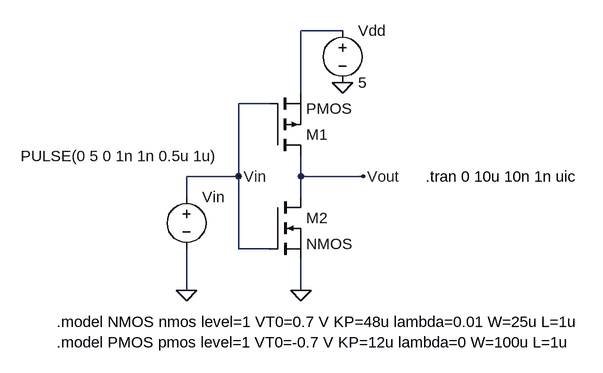
[diagram p0: schematic schema 1.3 Luca Fantin 2000156.asc]
schema 1.3 Luca Fantin 2000156.asc, the LTspice schematic file:
Version 4
SHEET 1 880 680
WIRE 320 -96 256 -96
WIRE 256 0 256 -96
WIRE 208 16 160 16
WIRE 160 128 160 16
WIRE 160 128 80 128
WIRE 256 128 256 96
WIRE 352 128 256 128
WIRE 80 160 80 128
WIRE 256 160 256 128
WIRE 160 240 160 128
WIRE 208 240 160 240
WIRE 80 304 80 240
WIRE 256 304 256 256
FLAG 352 128 Vout
FLAG 256 304 0
FLAG 320 -16 0
FLAG 80 304 0
FLAG 160 128 Vin
SYMBOL nmos 208 160 R0
SYMATTR InstName M2
SYMBOL voltage 320 -112 R0
SYMATTR InstName Vdd
SYMATTR Value 5
SYMBOL voltage 80 144 R0
WINDOW 3 -255 -47 Left 2
WINDOW 123 0 0 Left 0
WINDOW 39 0 0 Left 0
SYMATTR Value PULSE(0 5 0 1n 1n 0.5u 1u)
SYMATTR InstName Vin
SYMBOL pmos 208 96 M180
SYMATTR InstName M1
TEXT -120 352 Left 2 !.model NMOS nmos level=1 VT0=0.7 V KP=48u lambda=0.01 W=25u L=1u
TEXT -120 384 Left 2 !.model PMOS pmos level=1 VT0=-0.7 V KP=12u lambda=0 W=100u L=1u
TEXT 448 128 Left 2 !.tran 0 10u 10n 1n uic

The netlist it stands for:
* schema 1.3 Luca Fantin 2000156.asc
M2 Vout Vin 0 0 NMOS
Vdd N001 0 5
Vin Vin 0 PULSE(0 5 0 1n 1n 0.5u 1u)
M1 Vout Vin N001 N001 PMOS
.model NMOS NMOS
.model PMOS PMOS
.lib standard.mos
.model NMOS nmos level=1 VT0=0.7 V KP=48u lambda=0.01 W=25u L=1u
.model PMOS pmos level=1 VT0=-0.7 V KP=12u lambda=0 W=100u L=1u
.tran 0 10u 10n 1n uic
.backanno
.end

* Results of the author's LTspice run, read from the files saved beside the schematic
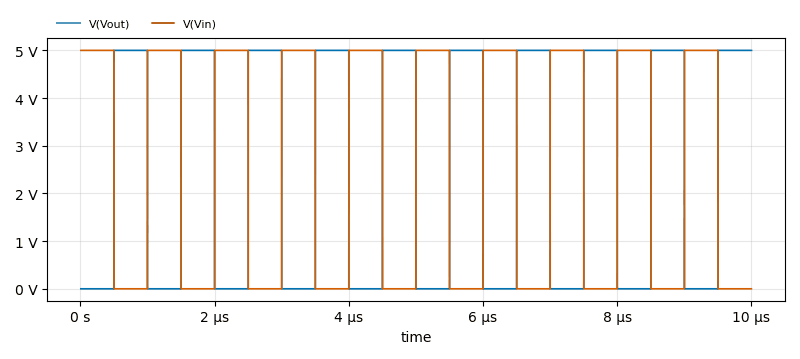
[diagram p1: Transient Analysis of schema 1.3 Luca Fantin 2000156.asc, plotted from the saved traces]
* Transient Analysis, 1 run:
*   V(Vout): min 0 V, max 5 V, average 2.497 V, rms 3.533 V, last 5 V
*   V(Vin): min 0 V, max 5 V, average 2.503 V, rms 3.536 V, last 0 V